# EAGLE design attiny85 (EAGLE 6.4)
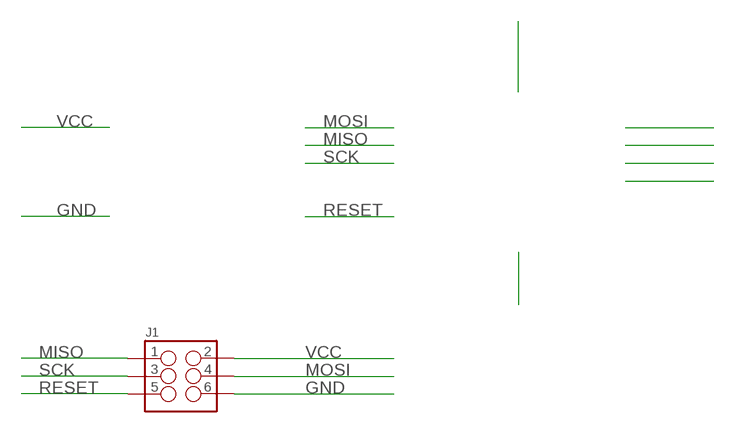
[diagram p0: schematic, sheet 1]

## Parts
J1  M03X2SMT  [2X3_SMT_POSTS]

## Nets
GND: J1.6
MISO: J1.1
MOSI: J1.4
RESET: J1.5
SCK: J1.3
VCC: J1.2

## Library data of the parts
J1 = SparkFun-Connectors:M03X2: 2x3 .1" header. Shrouded, with keying- CONN-10681 SMT- CONN-11415 Pogo pins- HW-11044; PROD_ID: CONN-11415

## Board
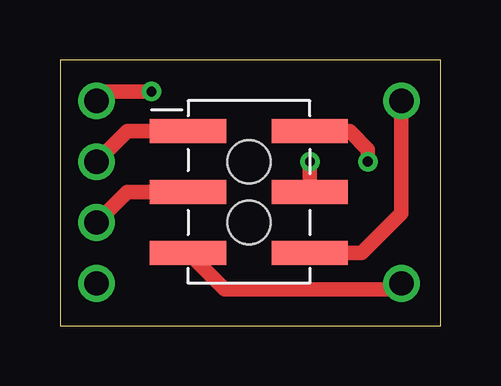
[diagram p1: board, top side]
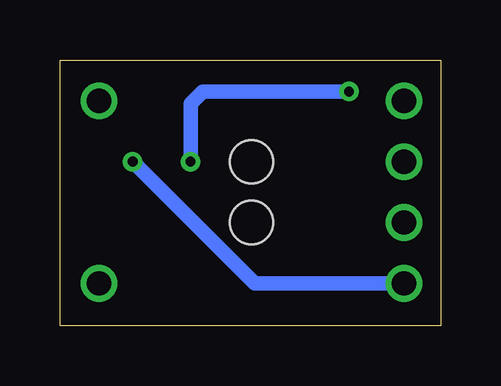
[diagram p2: board, bottom side, seen from below]

Size 15.86 x 11.1 mm. Coordinates in mm from the lower left corner, seen from the top.
Outline: 0,0 15.86,0 15.86,11.1 0,11.1 0,0
Copper layers (1*16): Top 0.035mm / dielectric 1.5mm / Bottom 0.035mm
Design rules "default": minimum track width 10mil, minimum drill 24mil, track to track 8mil, track to pad 8mil, pad to pad 8mil, via to via 8mil, smd to smd 8mil, copper to edge 40mil, drill to drill 8mil, minimum pad ring 10mil, minimum via ring 8mil, stop-mask expansion 4mil, vias tented up to drill 0mil, thermal gap 10mil

### Footprints (pad centres in the part's own frame; a part is rotated, then mirrored left to right if it is on the bottom)
2X3_SMT_POSTS = smd 1 x 3.17: 1 -2.54,-2.54; 2 -2.54,2.54; 3 0,-2.54; 4 0,2.54; 5 2.54,-2.54; 6 2.54,2.54 | hole 1.8: -1.27,0; 1.27,0

### Placement (x,y rotation side)
J1  7.87,5.59 270 top

### Tracks (layer width: path | path; a pad name or v marks a point on that pad's centre or on a via)
GND  (via drill 1.02 pad 1.27)
  Top 0.61: J1.6 12.57,3.05 14.22,4.7 v14.22,9.4
MISO  (via drill 1.02 pad 1.27)
  Top 0.61: v1.52,6.86 2.79,8.13 J1.1
MOSI  (via drill 0.41, 1.02 pad 1.27)
  Top 0.61: v1.52,9.4 1.91,9.78 v3.81,9.78 | J1.4 v10.41,6.86
  Bottom 0.61: v10.41,6.86 10.41,9.27 9.91,9.78 v3.81,9.78
RESET  (via drill 1.02 pad 1.27)
  Top 0.61: J1.5 6.86,1.52 13.97,1.52 v14.22,1.78
SCK  (via drill 1.02 pad 1.27)
  Top 0.61: v1.52,4.32 2.79,5.59 J1.3
VCC  (via drill 0.41, 1.02 pad 1.27)
  Top 0.61: v12.83,6.86 12.83,7.37 12.07,8.13 J1.2
  Bottom 0.61: v1.52,1.78 7.75,1.78 v12.83,6.86